# Altium schematic sheet ESP32_Block.SchDoc: Title
size A4; Date: *******; ApprovedBy: *******; CheckedBy: None; Author: *******; CompanyName: *******; DrawnBy: Name; Engineer: *******; Organization: *******; Address1: *******; Address2: *******; Address3: *******; Address4: *******; DocumentNumber: 6; Revision: *******; SheetNumber: 6; SheetTotal: 11; CurrentTime: *******; CurrentDate: *******; Time: *******; DocumentFullPathAndName: *******; DocumentName: *******; ModifiedDate: *******; ImagePath: *******; ProjectName: *******; Application_BuildNumber: *******
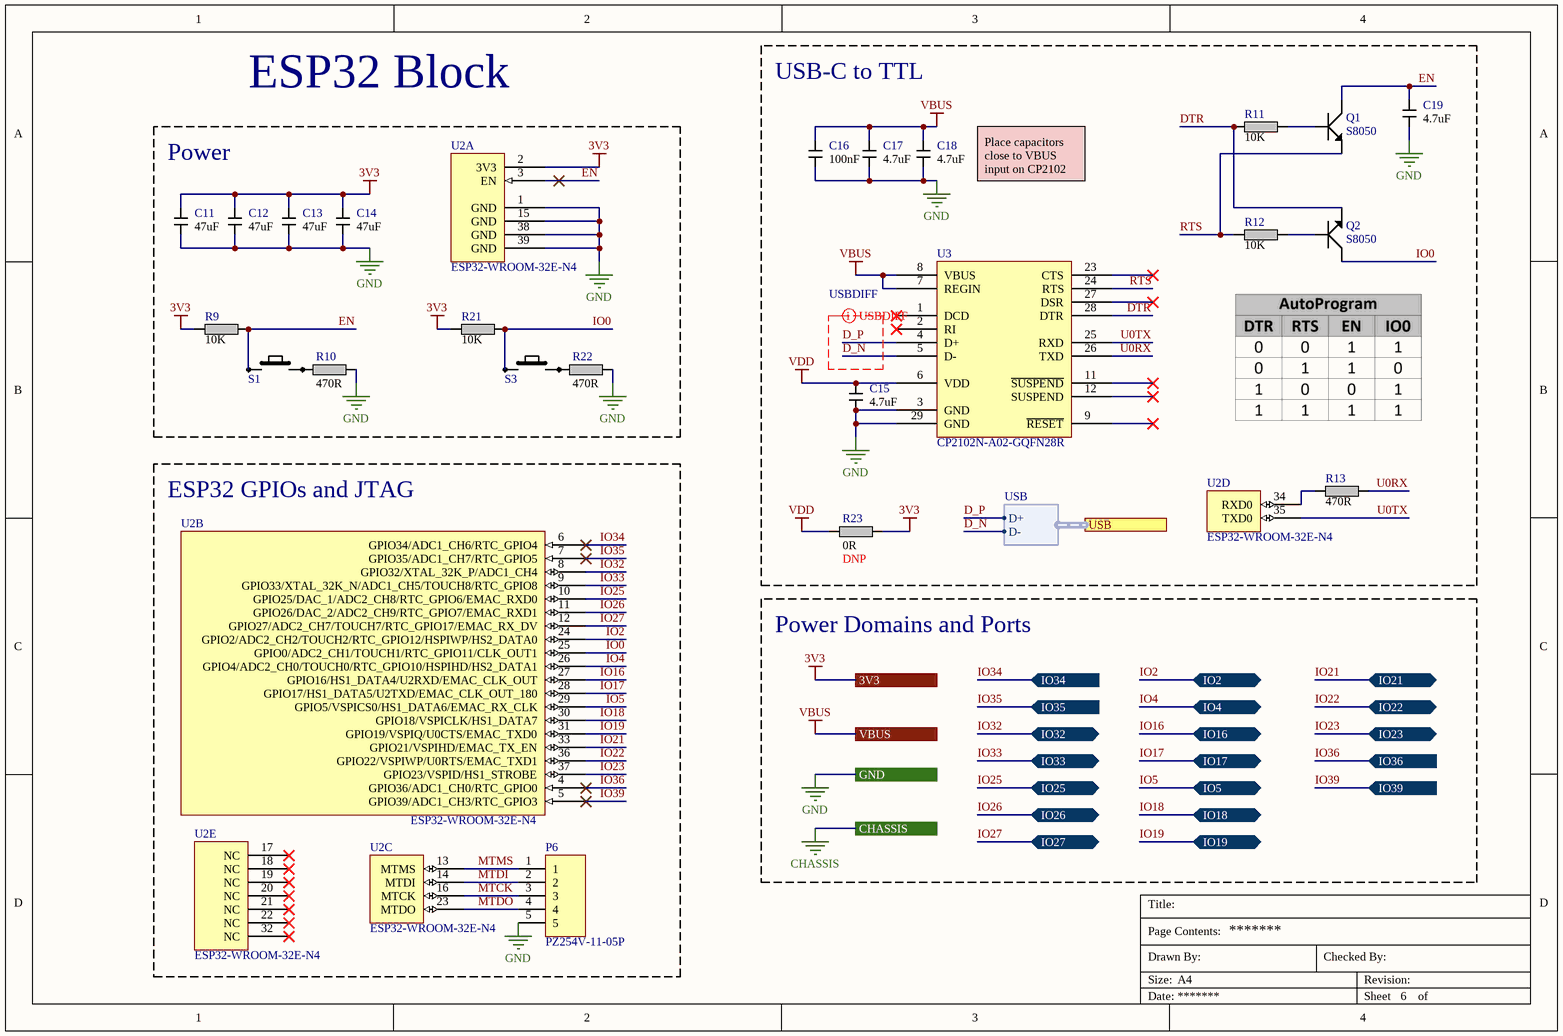
[diagram p0: ESP32_Block.SchDoc]

## Parts
C11  value 47uF  [1206]  (hidden comment: CAP)
C12  value 47uF  [1206]  (hidden comment: CAP)
C13  value 47uF  [1206]  (hidden comment: CAP)
C14  value 47uF  [1206]  (hidden comment: CAP)
C15  value 4.7uF  [0805]  (hidden comment: CAP)
C16  value 100nF  [0805]  (hidden comment: CAP)
C17  value 4.7uF  [0805]  (hidden comment: CAP)
C18  value 4.7uF  [0805]  (hidden comment: CAP)
C19  value 4.7uF  [0805]  (hidden comment: CAP)
P6  HEADER-5P-SR  [PZ254V-11-05P]  (value not drawn)
Q1  S8050  [SOT-23-3]
Q2  S8050  [SOT-23-3]
R9  value 10K  [0805]  (hidden comment: RES)
R10  value 470R  [0805]  (hidden comment: RES)
R11  value 10K  [0805]  (hidden comment: RES)
R12  value 10K  [0805]  (hidden comment: RES)
R13  value 470R  [0805]  (hidden comment: RES)
R21  value 10K  [0805]  (hidden comment: RES)
R22  value 470R  [0805]  (hidden comment: RES)
R23  value 0R  DM: DNP  [0805]  (hidden comment: RES)
S1  RST  [PUSHBUTTON_2]  (value not drawn)
S3  BOOT  [PUSHBUTTON_2]  (value not drawn)
U2  Manufacturer Part Number: ESP32-WROOM-32E-N4  [ESP32-WROOM-32E]  (hidden comment: ESP32-WROOM-32E)  (parts A,B,C,D,E of 5)
U3  Manufacturer Part Number: CP2102N-A02-GQFN28R  [CP2102N]  (hidden comment: CP2102)

## Blocks framed on the sheet
USB-C to TTL: C15-C19 Q1 Q2 R11-R13 R23 U2 U3
Power: C11-C14 R9 R10 R21 R22 S1 S3 U2
ESP32 GPIOs and JTAG: P6 U2

## Ports
3V3 (see ESP32_Module[1B], A4988[3B], ESP32_Module[3B], GPIO_Header[3B], I2C_Header[3B], Power[3B], SPI_Header[3B], Stepper_Driver[3A]), CHASSIS (see ESP32_Module[2C], Mechanical_Holes[3C], USB_Connector[3C]), GND (see ESP32_Module[1C], A4988[3B], ESP32_Module[3B], GPIO_Header[3B], I2C_Header[3B], Mechanical_Holes[3B], Power[3C], SPI_Header[3B], Stepper_Driver[3B], USB_Connector[3B]), IO2 (bidir, see ESP32_Module[1B], ESP32_Module[4B]), IO4 (bidir, see ESP32_Module[2B]), IO5 (bidir, see ESP32_Module[2B]), IO16 (bidir, see ESP32_Module[1B], ESP32_Module[3B]), IO17 (bidir, see ESP32_Module[1B], ESP32_Module[3B]), IO18 (bidir, see ESP32_Module[2B]), IO19 (bidir, see ESP32_Module[2B]), IO21 (bidir, see ESP32_Module[2B]), IO22 (bidir, see ESP32_Module[2B]), IO23 (bidir, see ESP32_Module[2B]), IO25 (bidir, see ESP32_Module[2B]), IO26 (bidir, see ESP32_Module[2B]), IO27 (bidir, see ESP32_Module[2B]), IO32 (bidir, see ESP32_Module[2B]), IO33 (bidir, see ESP32_Module[2B]), IO34 (in, see ESP32_Module[1B], ESP32_Module[3B]), IO35 (in, see ESP32_Module[1B], ESP32_Module[4B]), IO36 (in, see ESP32_Module[1B], ESP32_Module[3B]), IO39 (in, see ESP32_Module[1B], ESP32_Module[4B]), USB (harness USB, see ESP32_Module[2B], USB_Connector[3C]), VBUS (see ESP32_Module[1B], ESP32_Module[4B], Power[3B], USB_Connector[3B])

## Harnesses
USB: D+, D-

## Nets
3V3: C11.1 C12.1 C13.1 C14.1 R9.2 R21.2 R23.1 U2.2(3V3) ; port 3V3
CHASSIS: port CHASSIS
GND: C11.2 C12.2 C13.2 C14.2 C15.2 C16.1 C17.2 C18.2 C19.2 P6.5 R10.1 R22.1 U2.1(GND) U2.15(GND) U2.38(GND) U2.39(GND) U3.3(GND) U3.29(GND) ; port GND
VBUS: C16.2 C17.1 C18.1 U3.7(REGIN) U3.8(VBUS) ; port VBUS
VDD: C15.1 R23.2 U3.6(VDD)
D_N: U3.5(D-) ; port USB.D-
D_P: U3.4(D+) ; port USB.D+
DTR: Q2.2 R11.2 U3.28(DTR)
EN: C19.1 Q1.3 R9.1 S1.1 U2.3(EN)
IO0: Q2.3 R21.1 S3.1 U2.25(GPIO0/ADC2_CH1/TOUCH1/RTC_GPIO11/CLK_OUT1)
IO2: U2.24(GPIO2/ADC2_CH2/TOUCH2/RTC_GPIO12/HSPIWP/HS2_DATA0) ; port IO2
IO4: U2.26(GPIO4/ADC2_CH0/TOUCH0/RTC_GPIO10/HSPIHD/HS2_DATA1) ; port IO4
IO5: U2.29(GPIO5/VSPICS0/HS1_DATA6/EMAC_RX_CLK) ; port IO5
IO16: U2.27(GPIO16/HS1_DATA4/U2RXD/EMAC_CLK_OUT) ; port IO16
IO17: U2.28(GPIO17/HS1_DATA5/U2TXD/EMAC_CLK_OUT_180) ; port IO17
IO18: U2.30(GPIO18/VSPICLK/HS1_DATA7) ; port IO18
IO19: U2.31(GPIO19/VSPIQ/U0CTS/EMAC_TXD0) ; port IO19
IO21: U2.33(GPIO21/VSPIHD/EMAC_TX_EN) ; port IO21
IO22: U2.36(GPIO22/VSPIWP/U0RTS/EMAC_TXD1) ; port IO22
IO23: U2.37(GPIO23/VSPID/HS1_STROBE) ; port IO23
IO25: U2.10(GPIO25/DAC_1/ADC2_CH8/RTC_GPIO6/EMAC_RXD0) ; port IO25
IO26: U2.11(GPIO26/DAC_2/ADC2_CH9/RTC_GPIO7/EMAC_RXD1) ; port IO26
IO27: U2.12(GPIO27/ADC2_CH7/TOUCH7/RTC_GPIO17/EMAC_RX_DV) ; port IO27
IO32: U2.8(GPIO32/XTAL_32K_P/ADC1_CH4) ; port IO32
IO33: U2.9(GPIO33/XTAL_32K_N/ADC1_CH5/TOUCH8/RTC_GPIO8) ; port IO33
IO34: U2.6(GPIO34/ADC1_CH6/RTC_GPIO4) ; port IO34
IO35: U2.7(GPIO35/ADC1_CH7/RTC_GPIO5) ; port IO35
IO36: U2.4(GPIO36/ADC1_CH0/RTC_GPIO0) ; port IO36
IO39: U2.5(GPIO39/ADC1_CH3/RTC_GPIO3) ; port IO39
MTCK: P6.3 U2.16(MTCK)
MTDI: P6.2 U2.14(MTDI)
MTDO: P6.4 U2.23(MTDO)
MTMS: P6.1 U2.13(MTMS)
RTS: Q1.2 R12.2 U3.24(RTS)
U0RX: R13.2 U3.26(TXD)
U0TX: U2.35(TXD0) U3.25(RXD)
NetQ1_1: Q1.1 R11.1
NetQ2_1: Q2.1 R12.1
NetR10_2: R10.2 S1.2
NetR13_1: R13.1 U2.34(RXD0)
NetR22_2: R22.2 S3.2

Not connected (* = marked no-connect by the designer): U2 17(NC)* 18(NC)* 19(NC)* 20(NC)* 21(NC)* 22(NC)* 32(NC)*; U3 1(DCD)* 2(RI)* 9(~{RESET})* 11(~{SUSPEND})* 12(SUSPEND)* 23(CTS)* 27(DSR)*

## Layout directives
differential pair; differential pair class USBDIFF: D_N, D_P

## Notes on the sheet
- ESP32 Block
- Place capacitors close to VBUS input on CP2102
- Power Domains and Ports
- Title:
- Size:
- Date:
- Drawn By:
- Page Contents:
- A4
- Checked By:
- Revision:
- Sheet
- of

## Library data of the parts
C11-C14 = CAP: 25V 47uF X5R ±20% 1206  Multilayer Ceramic Capacitors MLCC - SMD/SMT ROHS; Manufacturer: TDK; Manufacturer Part Number: C3216X5R1E476MTJ00E; Supplier: JLCPCB; Supplier Part Number: C76659
C15 C17-C19 = CAP: 35V 4.7uF X7R ±10% 0805  Multilayer Ceramic Capacitors MLCC - SMD/SMT ROHS; Manufacturer: Samwha Capacitor; Manufacturer Part Number: CS2012X7R475K350NRE; Supplier: JLCPCB; Supplier Part Number: C560882
C16 = CAP: 50V 100nF X7R ±10% 0805  Multilayer Ceramic Capacitors MLCC - SMD/SMT ROHS; Manufacturer: YAGEO; Manufacturer Part Number: CC0805KRX7R9BB104; Supplier: JLCPCB; Supplier Part Number: C49678
P6 = HEADER-5P-SR: Straight Square Pins 2.5mm 6mm -40℃~+105℃ 3mm 5 2.54mm Black Brass 1x5P Plugin,P=2.54mm  Pin Headers ROHS; Manufacturer: XFCN; Supplier: JLCPCB; Supplier Part Number: C492404; Manufacturer Part Number: PZ254V-11-05P
Q1 Q2 = S8050: 25V 300mW 500mA SOT-23  Bipolar Transistors - BJT ROHS; Manufacturer: JSMSEMI; Supplier: JLCPCB; Supplier Part Number: C916390; Manufacturer Part Number: S8050
R9 R11 R12 R21 = RES: 125mW Thick Film Resistors ±1% 10kΩ 0805  Chip Resistor - Surface Mount ROHS; Manufacturer: UNI-ROYAL(Uniroyal Elec); Manufacturer Part Number: 0805W8F1002T5E; Supplier: JLCPCB; Supplier Part Number: C17414
R10 R13 R22 = RES: 125mW Thick Film Resistors ±1% 470Ω 0805  Chip Resistor - Surface Mount ROHS; Manufacturer: UNI-ROYAL(Uniroyal Elec); Manufacturer Part Number: 0805W8F4700T5E; Supplier: JLCPCB; Supplier Part Number: C17710
R23 = RES: 125mW 0Ω 0805 Chip Resistor - Surface Mount ROHS; Manufacturer: PANASONIC; Manufacturer Part Number: ERJ6GEY0R00V; Supplier: JLCPCB; Supplier Part Number: C169855
S1 S3 = PUSHBUTTON_2: SWITCH TACTILE SPST-NO 0.05A 12V; Manufacturer: C&K; Manufacturer Part Number: PTS645SM43SMTR92LFS; Supplier: JLCPCB; Supplier Part Number: C221880
U2 = ESP32-WROOM-32E: RX TXRX MOD WIFI TRACE ANT SMD; Manufacturer: Espressif Systems; Supplier: JLCPCB; Supplier Part Number: C701341
U3 = CP2102: QFN-28 USB ICs ROHS; Manufacturer: SILICON LABS; Supplier: JLCPCB; Supplier Part Number: C964632